# Altium project iMX6 Rex Development Baseboard V1I1.PrjPcb (part 4 of 5)

## Sheet [14] - RTC, EEPROM, GPIO, TOUCH SCREEN.SchDoc
size A3; DocumentNumber: 2; SheetNumber: 14; SheetTotal: 20
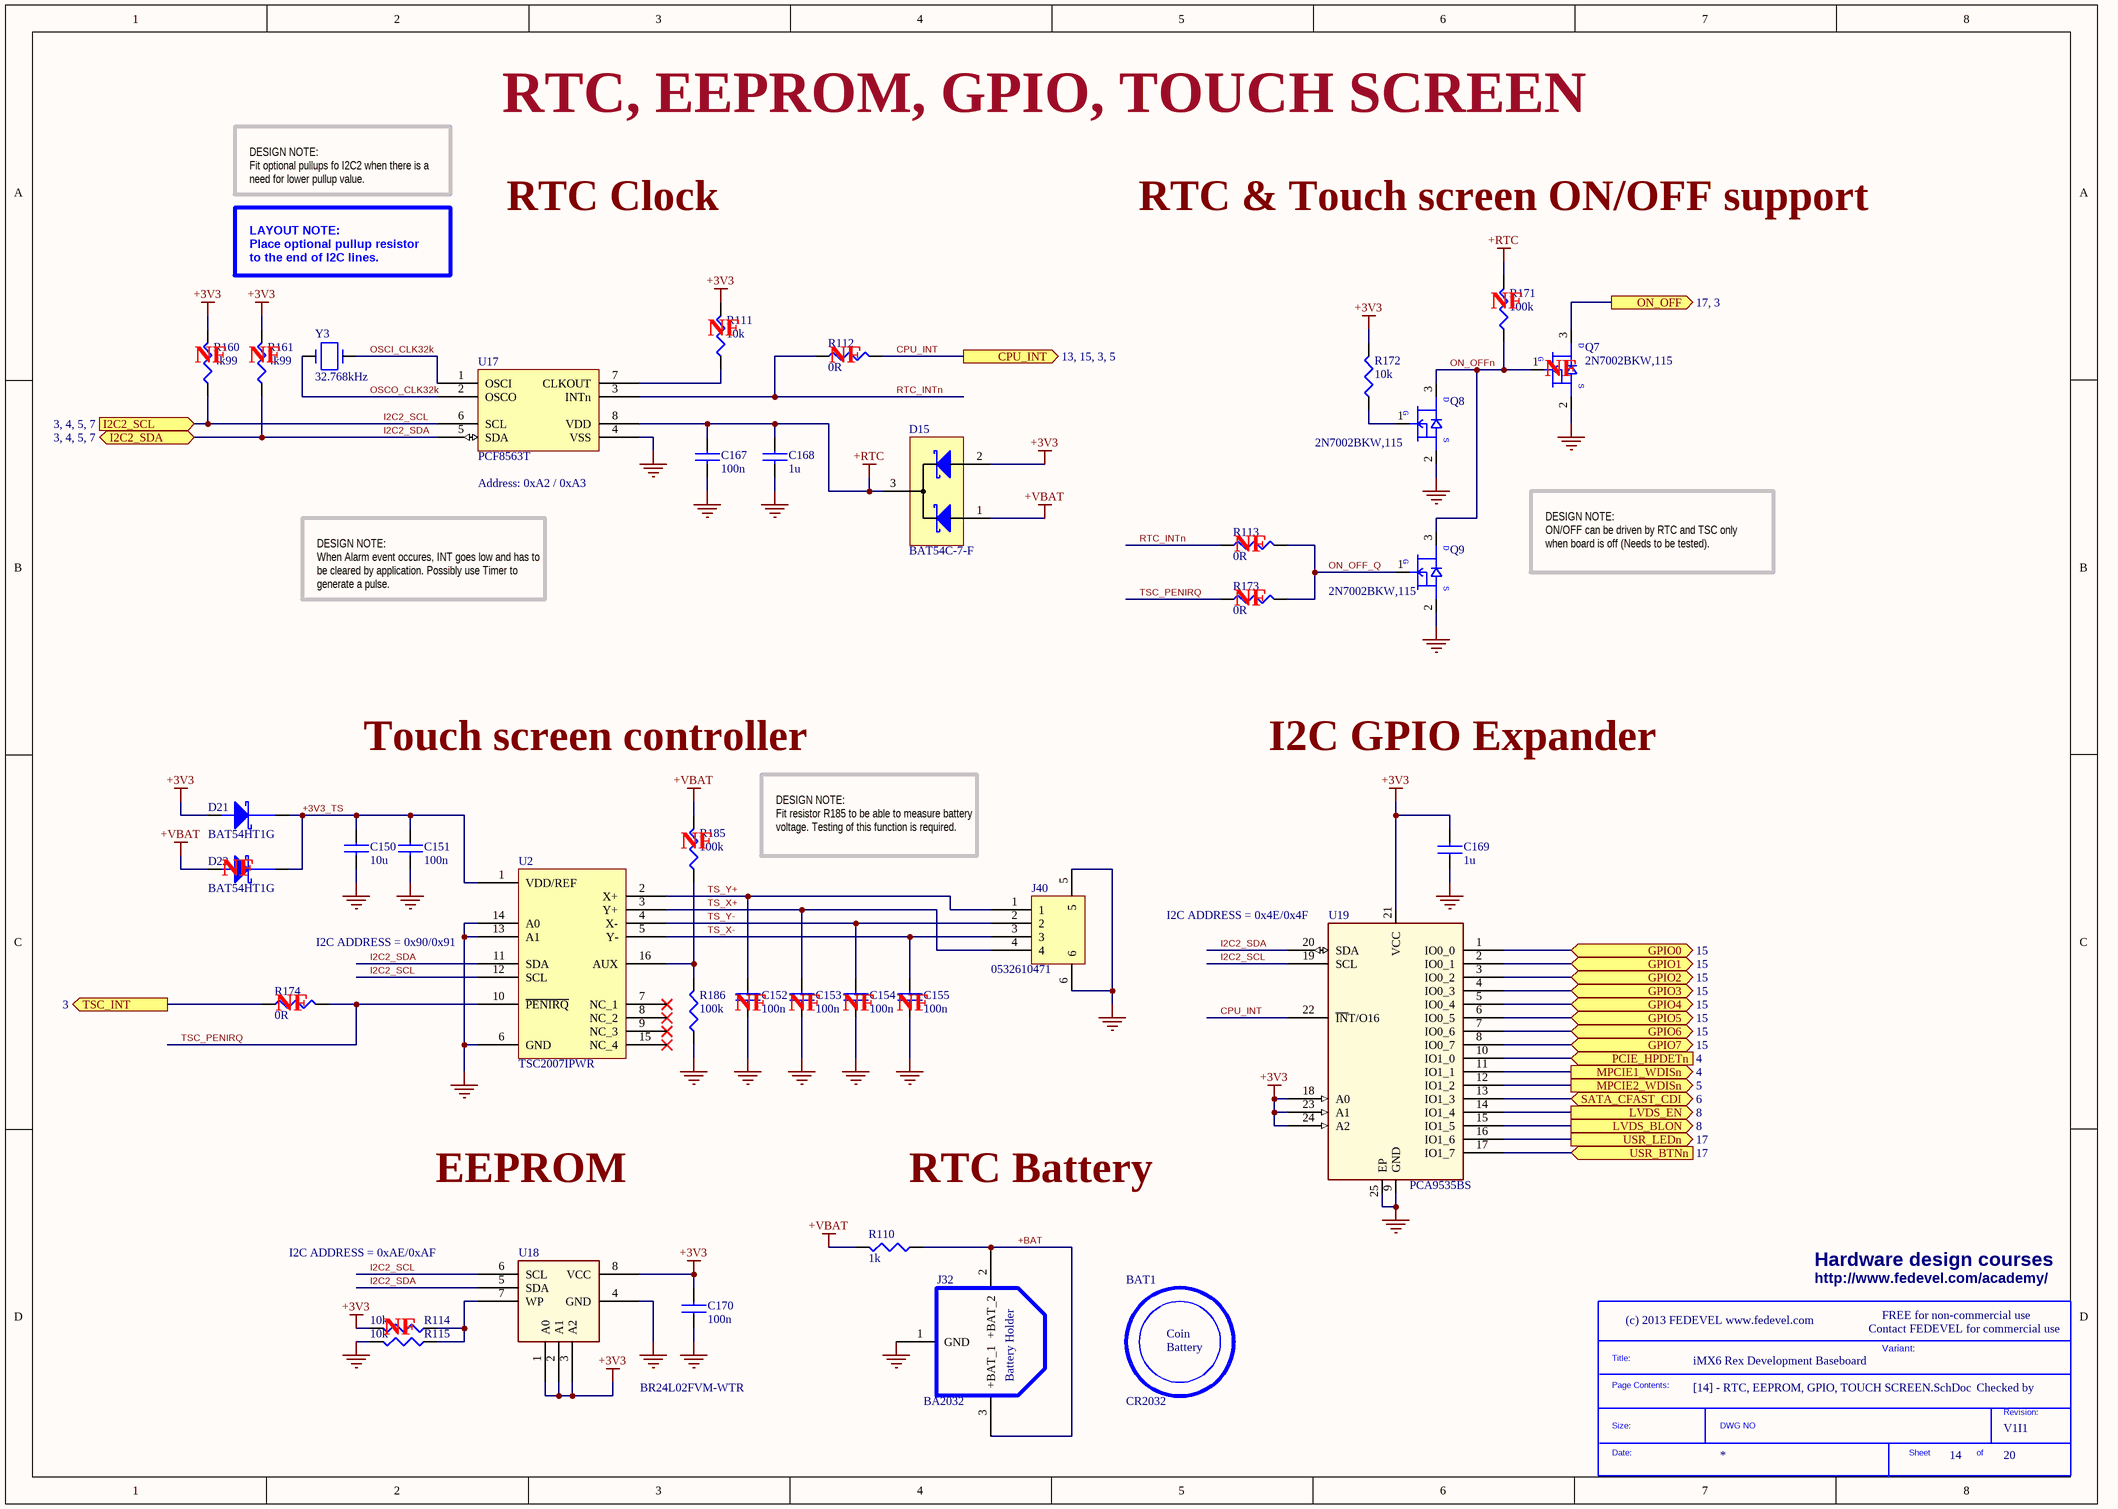
[diagram p10: [14] - RTC, EEPROM, GPIO, TOUCH SCREEN.SchDoc]

### Parts
(Parts that share a designator on the sheet are numbered #1, #2 ... from top to bottom, then left to right.)
*#9  SDTitleBlock  (value not drawn)  (graphical)
BAT1  CR2032  (mechanical)
C150  10u  [C0603]
C151  100n  [C0402]
C152  100n  [C0402]
C153  100n  [C0402]
C154  100n  [C0402]
C155  100n  [C0402]
C167  100n  [C0402]
C168  1u  [C0402]
C169  1u  [C0402]
C170  100n  [C0402]
D15  BAT54C-7-F  [SOT-23-3-123]
D21  BAT54HT1G  [SOD323]
D22  BAT54HT1G  [SOD323]
J32  BA2032  [BA2032]
J40  0532610471  [0532610471]
Q7  2N7002BKW,115  [SC70_SOT323]
Q8  2N7002BKW,115  [SC70_SOT323]
Q9  2N7002BKW,115  [SC70_SOT323]
R110  1k  [R0402]
R111  10k  [R0402]
R112  0R  [R0402]
R113  0R  [R0402]
R114  10k  [R0402]
R115  10k  [R0402]
R160  4k99  [R0402]
R161  4k99  [R0402]
R171  100k  [R0402]
R172  10k  [R0402]
R173  0R  [R0402]
R174  0R  [R0402]
R185  100k  [R0402]
R186  100k  [R0402]
U2  TSC2007IPWR  [PW (R-PDGO-G16)]
U17  PCF8563T  [8_SOIC_3.9MM]
U18  BR24L02FVM-WTR  [MSOP8 _SMALLER]
U19  PCA9535BS  [HVQFN24_4x4MM]
Y3  32.768kHz  [ABS06]

### Ports
CPU_INT (out, see 13, 15, 3, 5), GPIO0 (bidir, see 15), GPIO1 (bidir, see 15), GPIO2 (bidir, see 15), GPIO3 (bidir, see 15), GPIO4 (bidir, see 15), GPIO5 (bidir, see 15), GPIO6 (bidir, see 15), GPIO7 (bidir, see 15), I2C2_SCL (see 3, 4, 5, 7), I2C2_SDA (bidir, see 3, 4, 5, 7), LVDS_BLON (out, see 8), LVDS_EN (out, see 8), MPCIE1_WDISn (out, see 4), MPCIE2_WDISn (out, see 5), ON_OFF (out, see 17, 3), PCIE_HPDETn (in, see 4), SATA_CFAST_CDI (bidir, see 6), TSC_INT (out, see 3), USR_BTNn (in, see 17), USR_LEDn (out, see 17)

### Nets
+3V3: C169.2 C170.2 D15.2 D21.2(Anode) R111.2 R114.2 R160.2 R161.2 R172.2 U18.1(A0) U18.2(A1) U18.3(A2) U18.8(VCC) U19.18(A0) U19.21(VCC) U19.23(A1) U19.24(A2)
+RTC: C167.1 C168.1 D15.3 R171.2 U17.8(VDD)
+VBAT: D15.1 D22.2(Anode) R110.2 R185.2
GND: C150.2 C151.2 C152.2 C153.2 C154.2 C155.2 C167.2 C168.2 C169.1 C170.1 J32.1(GND) J40.5 J40.6 Q7.2(SOURCE) Q8.2(SOURCE) Q9.2(SOURCE) R115.2 R186.1 U2.6(GND) U2.13(A1) U2.14(A0) U17.4(VSS) U18.4(GND) U19.9(GND) U19.25(EP)
+3V3_TS: C150.1 C151.1 D21.1(Cathode) D22.1(Cathode) U2.1(VDD/REF)
+BAT: J32.2(+BAT_2) J32.3(+BAT_1) R110.1
CPU_INT: R112.2 U19.22(~{IN}T/O16) ; port CPU_INT
GPIO0: U19.1(IO0_0) ; port GPIO0
GPIO1: U19.2(IO0_1) ; port GPIO1
GPIO2: U19.3(IO0_2) ; port GPIO2
GPIO3: U19.4(IO0_3) ; port GPIO3
GPIO4: U19.5(IO0_4) ; port GPIO4
GPIO5: U19.6(IO0_5) ; port GPIO5
GPIO6: U19.7(IO0_6) ; port GPIO6
GPIO7: U19.8(IO0_7) ; port GPIO7
I2C2_SCL: R160.1 U2.12(SCL) U17.6(SCL) U18.6(SCL) U19.19(SCL) ; port I2C2_SCL
I2C2_SDA: R161.1 U2.11(SDA) U17.5(SDA) U18.5(SDA) U19.20(SDA) ; port I2C2_SDA
LVDS_BLON: U19.15(IO1_5) ; port LVDS_BLON
LVDS_EN: U19.14(IO1_4) ; port LVDS_EN
MPCIE1_WDISn: U19.11(IO1_1) ; port MPCIE1_WDISn
MPCIE2_WDISn: U19.12(IO1_2) ; port MPCIE2_WDISn
ON_OFF: Q7.3(DRAIN) ; port ON_OFF
ON_OFF_Q: Q9.1(GATE) R113.2 R173.2
ON_OFFn: Q7.1(GATE) Q8.3(DRAIN) Q9.3(DRAIN) R171.1
OSCI_CLK32k: U17.1(OSCI) Y3.1
OSCO_CLK32k: U17.2(OSCO) Y3.2
PCIE_HPDETn: U19.10(IO1_0) ; port PCIE_HPDETn
RTC_INTn: R112.1 R113.1 U17.3(INTn)
SATA_CFAST_CDI: U19.13(IO1_3) ; port SATA_CFAST_CDI
TS_X+: C153.1 J40.4 U2.3(Y+)
TS_X-: C155.1 J40.3 U2.5(Y-)
TS_Y+: C152.1 J40.1 U2.2(X+)
TS_Y-: C154.1 J40.2 U2.4(X-)
TSC_INT: R174.1 ; port TSC_INT
TSC_PENIRQ: R173.1 R174.2 U2.10(~{PENIRQ})
USR_BTNn: U19.17(IO1_7) ; port USR_BTNn
USR_LEDn: U19.16(IO1_6) ; port USR_LEDn
NetQ8_1: Q8.1(GATE) R172.1
NetR111_1: R111.1 U17.7(CLKOUT)
NetR114_1: R114.1 R115.1 U18.7(WP)
NetR185_1: R185.1 R186.2 U2.16(AUX)

Not connected (* = marked no-connect by the designer): U2 7(NC_1)* 8(NC_2)* 9(NC_3)* 15(NC_4)*

### Notes on the sheet
- RTC, EEPROM, GPIO, TOUCH SCREEN
- DESIGN NOTE:
  Fit optional pullups fo I2C2 when there is a need for lower pullup value.
- RTC Clock
- RTC & Touch screen ON/OFF support
- LAYOUT NOTE:
  Place optional pullup resistor to the end of I2C lines.
- (near R171) NF
- (near R160) NF
- (near R161) NF
- (near R111) NF
- (near R112) NF
- (near Q7) NF
- (near U17) Address: 0xA2 / 0xA3
- (near R113) NF
- DESIGN NOTE:
  ON/OFF can be driven by RTC and TSC only when board is off (Needs to be tested).
- DESIGN NOTE:
  When Alarm event occures, INT goes low and has to be cleared by application. Possibly use Timer to generate a pulse.
- (near R173) NF
- Touch screen controller
- I2C GPIO Expander
- (near R185) NF
- DESIGN NOTE:
  Fit resistor R185 to be able to measure battery voltage. Testing of this function is required.
- (near D22) NF
- (near U19) I2C ADDRESS = 0x4E/0x4F
- I2C ADDRESS = 0x90/0x91
- (near R174) NF
- (near C152) NF
- (near C153) NF
- (near C154) NF
- (near C155) NF
- EEPROM
- RTC Battery
- I2C ADDRESS = 0xAE/0xAF
- Hardware design courses
- http://www.fedevel.com/academy/
- Contact FEDEVEL for commercial use
- FREE for non-commercial use
- NF
- Variant:
- Checked by
- (in symbol 2N7002BKW,115) D; G; S
- (in symbol BA2032) Battery Holder
- (in symbol CR2032) Coin; Battery
- (in symbol SDTitleBlock) Title:; Page Contents:; Revision:; Size:; DWG NO; Date:; Sheet; of

### Library data of the parts
BAT1 = CR2032: BATTERY LITHIUM COIN 3V 20MM; Manufacturer: Panasonic - BSG; Battery Cell Size: Coin, 20.0mm; Capacity: 225mAh; Discharge Rate: 200µA; Shipping Info: Due to possible restrictions, a change in ship method may be required.; .Checked SCH: RF; Supplier 1: Digi-Key; Manufacturer Part Number: CR2032; RoHS: RoHS Compliant By Exemption; Category: Battery Products; Stock 1: 2691411; Pricing 1: 1=0.28, 10=0.248, 50=0.22, 200=0.1925, 400=0.176, 800=0.165, 1200=0.15125 (USD); Battery Chemistry: Lithium; Voltage - Rated: 3V; Size / Dimension: 0.79" Dia x 0.13" H (20.0mm x 3.2mm); Termination Style: Requires Holder; Weight: 0.1 oz (2.85g); ComponentLink1URL: http://panasonic.com/industrial/includes/pdf/Panasonic_Lithium_CR2032_CR2330.pdf; ComponentLink1Description: http://panasonic.com/industrial/includes/pdf/Panasonic_Lithium_CR2032_CR2330.pdf; Supplier Part Number 1: P189-ND; .Checked PCB: RF
C150 = C1608X5R0J106M: CAP CER 10UF 6.3V X5R 20% 0603; Manufacturer: TDK Corporation; Capacitance: 10µF; Value: 10µF; .Checked PCB: used; Description: CAP CER 10UF 6.3V 20% X5R 0603; Category: Capacitors; Supplier Part Number: 445-4112-1-ND; Manufacturer Part Number: C1608X5R0J106M; Operating Temperature: -55°C ~ 85°C; Package / Case: 0603 (1608 Metric); Price 1k [$]: 0.08580; .Checked SCH: used; Voltage - Rated: 6.3V; Features: Low ESR; Supplier: Digikey; Supplier 1: Digi-Key; Supplier Part Number 1: 445-4112-1-ND; RoHS: RoHS Compliant; Stock 1: 48157; Pricing 1: 1=0.46, 10=0.363, 100=0.1898, 250=0.14024, 500=0.1089, 1000=0.0858 (USD); Tolerance: ±20%; Temperature Coefficient: X5R; Mounting Type: Surface Mount, MLCC; Applications: General Purpose; Ratings: -; Size / Dimension: 0.063" L x 0.031" W (1.60mm x 0.80mm); Height - Seated (Max): -; Thickness (Max): 0.037" (0.95mm); Lead Spacing: -; Packaging: Cut Tape (CT); Lead Style: -; ComponentLink1URL: http://www.tdk.com/pdf/general_B11.pdf; ComponentLink1Description: http://www.tdk.com/pdf/general_B11.pdf
C151-C155 C167 C170 = C1005X5R1H104K: CAP CER .10UF 50V X5R 10% 0402; Manufacturer: TDK Corporation; Capacitance: 0.1µF; Value: 100nF; .Checked PCB: used; Description: CAP CER 0.1UF 50V 10% X5R 0402; Category: Capacitors; Supplier Part Number: 445-5942-1-ND; Manufacturer Part Number: C1005X5R1H104K; Operating Temperature: -55°C ~ 85°C; Package / Case: 0402 (1005 Metric); Price 1k [$]: 0.02340; .Checked SCH: used; Voltage - Rated: 50V; Supplier: Digikey; Supplier 1: Digi-Key; Supplier Part Number 1: 445-5942-1-ND; RoHS: RoHS Compliant; Stock 1: 106926; Pricing 1: 1=0.27, 10=0.18, 100=0.072, 250=0.05176, 500=0.0369, 1000=0.027 (USD); Tolerance: ±10%; Temperature Coefficient: X5R; Mounting Type: Surface Mount, MLCC; Applications: General Purpose; Ratings: -; Size / Dimension: 0.039" L x 0.020" W (1.00mm x 0.50mm); Height - Seated (Max): -; Thickness (Max): 0.022" (0.55mm); Lead Spacing: -; Features: -; Packaging: Cut Tape (CT); Lead Style: -; ComponentLink1URL: http://www.tdk.co.jp/tefe02/e412_c.pdf; ComponentLink1Description: http://www.tdk.co.jp/tefe02/e412_c.pdf
C168 C169 = C1005X5R1C105K: CAP CER 1.0UF 16V X5R 0402; Manufacturer: TDK Corporation; Capacitance: 1.0µF; Value: 1uF; .Checked PCB: used; Description: CAP CER 1UF 16V 10% X5R 0402; Tolerance: ±10%; Category: Capacitors; Manufacturer Part Number: C1005X5R1C105K; Operating Temperature: -55°C ~ 85°C; Package / Case: 0402 (1005 Metric); Price 1k [$]: 0.02080; .Checked SCH: used; Voltage - Rated: 16V; Supplier Part Number: 445-4978-1-ND; Supplier: Digikey; Supplier 1: Digi-Key; Supplier Part Number 1: 445-4978-1-ND; RoHS: RoHS Compliant; Stock 1: 341010; Pricing 1: 1=0.24, 10=0.16, 100=0.064, 250=0.046, 500=0.0328, 1000=0.024 (USD); Temperature Coefficient: X5R; Mounting Type: Surface Mount, MLCC; Applications: General Purpose; Ratings: -; Size / Dimension: 0.039" L x 0.020" W (1.00mm x 0.50mm); Height - Seated (Max): -; Thickness (Max): 0.022" (0.55mm); Lead Spacing: -; Features: -; Packaging: Cut Tape (CT); Lead Style: -; ComponentLink1URL: http://www.tdk.co.jp/tefe02/e412_c.pdf; ComponentLink1Description: http://www.tdk.co.jp/tefe02/e412_c.pdf
D15 = BAT54C-7-F: DIODE SCHOTTKY DUAL 30V SOT23-3; Manufacturer: Diodes Inc; .Checked PCB: used; Current - Average Rectified (Io) (per Diode): 200mA (DC; Speed: Small Signal =< 200mA (Io), Any Speed; Voltage - Forward (Vf) (Max) @ If: 800mV @ 100mA; Current - Reverse Leakage @ Vr: 2µA @ 25V; Reverse Recovery Time (trr): 5ns; Diode Configuration: 1 Pair Common Cathode; .Checked SCH: used; Category: Discrete Semiconductor Products; Manufacturer Part Number: BAT54C-7-F; Package / Case: TO-236-3, SC-59, SOT-23-3; Price 1k [$]: 0.04500; Value: BAT54C-7-F; Family: Diodes, Rectifiers - Arrays; oltage - DC Reverse (Vr) (Max): 30V; Diode Type: Schottky; Supplier Part Number: BAT54C-FDICT-ND; Supplier: Digikey; Supplier 1: Digi-Key; Supplier Part Number 1: BAT54C-FDICT-ND; RoHS: RoHS Compliant; Stock 1: 67687; Pricing 1: 1=0.38, 10=0.255, 100=0.12, 250=0.08552, 500=0.06526, 1000=0.045 (USD); Voltage - DC Reverse (Vr) (Max): 30V; Mounting Type: Surface Mount; Supplier Device Package: SOT-23-3; Packaging: Cut Tape (CT); ComponentLink1URL: http://www.diodes.com/datasheets/ds11005.pdf; ComponentLink1Description: http://www.diodes.com/datasheets/ds11005.pdf
D21 D22 = BAT54HT1G: DIODE SCHOTTKY 30V 0.2A SOD323; Manufacturer: Fairchild Semiconductor; Current - Average Rectified (Io): 200mA; Voltage - Forward (Vf) (Max) @ If: 800mV @ 100mA; Speed: Small Signal =< 200mA (Io), Any Speed; Reverse Recovery Time (trr): 5ns; Current - Reverse Leakage @ Vr: 2µA @ 25V; Capacitance @ Vr, F: 10pF @ 1V, 1MHz; Thermal Resistance: 600°C/W Ja; .Creator: MM; .Checked PCB: RF, used by MM; Supplier 1: Digi-Key; Manufacturer Part Number: BAT54HT1G; RoHS: RoHS Compliant; Category: Discrete Semiconductor Products; Stock 1: 11388; Pricing 1: 1=0.3, 10=0.276, 25=0.1984, 100=0.1543, 250=0.09696, 500=0.0826, 1000=0.05628 (USD); Packaging: Cut Tape (CT); Diode Type: Schottky; Voltage - DC Reverse (Vr) (Max): 30V; Mounting Type: Surface Mount; Package / Case: SC-76, SOD-323; Supplier Device Package: SOD-323; Operating Temperature - Junction: -55°C ~ 150°C; ComponentLink1URL: http://www.fairchildsemi.com/ds/BA/BAT54HT1G.pdf; ComponentLink1Description: http://www.fairchildsemi.com/ds/BA/BAT54HT1G.pdf; Supplier Part Number 1: BAT54HT1GCT-ND; .Checked SCH: MM
J32 = BA2032: HOLDER COIN CELL CR2032 EJECT; Manufacturer: MPD (Memory Protection Devices); Battery Type, Function: Coin Cell, Holder; Style: Holder (Open); Battery Cell Size: Coin, 20.0mm; Number of Cells: 1; Battery Series: 2032; .Creator: MM; .Checked SCH: RF, used by MM; Supplier 1: Digi-Key; Manufacturer Part Number: BA2032; RoHS: RoHS Compliant; Category: Battery Products; Stock 1: 59526; Pricing 1: 1=1.16, 10=1.077, 100=0.97, 500=0.83, 1000=0.72 (USD); Mounting Type: PCB, Through Hole; Termination Style: PC Pin; Height Above Board: 0.264" (6.71mm); Operating Temperature: -40°C ~ 225°C; ComponentLink1URL: http://www.memoryprotectiondevices.com/datasheets/BA2032-datasheet.pdf; ComponentLink1Description: http://www.memoryprotectiondevices.com/datasheets/BA2032-datasheet.pdf; Supplier Part Number 1: BA2032-ND; .Checked PCB: MM
J40 = 0532610471: CONN HEADER 4POS 1.25MM R/A SMD; Manufacturer: Molex Inc; Connector Type: Header, Shrouded; Number of Positions: 4; Number of Positions Loaded: All; Pitch: 0.049" (1.25mm); .Creator: MM; Supplier 1: Digi-Key; Manufacturer Part Number: 0532610471; RoHS: RoHS Compliant; Category: Connectors, Interconnects; Stock 1: 9616; Pricing 1: 1=1.5, 10=1.318, 25=1.2404, 50=1.1888, 100=1.1372, 250=1.0338, 500=0.9304 (USD); Packaging: Cut Tape (CT); Contact Type: Blade Pin; Number of Rows: 1; Row Spacing: -; Contact Mating Length: -; Mounting Type: Surface Mount, Right Angle; Termination: Solder; Fastening Type: -; Features: Solder Retention; Contact Finish: Tin; Contact Finish Thickness: 39µin (1.00µm); Color: Natural; ComponentLink1URL: http://www.molex.com/pdm_docs/sd/532610471_sd.pdf; ComponentLink1Description: http://www.molex.com/pdm_docs/sd/532610471_sd.pdf; Supplier Part Number 1: WM7622CT-ND; .Checked PCB: MM; .Checked SCH: MM
Q7-Q9 = 2N7002BKW,115: MOSFET N-CH 60V 310MA SOT323; Manufacturer: NXP Semiconductors; FET Type: MOSFET N-Channel, Metal Oxide; FET Feature: Logic Level Gate; Rds On (Max) @ Id, Vgs: 1.6 Ohm @ 500mA, 10V; Vgs(th) (Max) @ Id: 2.1V @ 250µA; Gate Charge (Qg) @ Vgs: 0.6nC @ 4.5V; Input Capacitance (Ciss) @ Vds: 50pF @ 10V; Power - Max: 275mW; .Checked PCB: RF; Supplier 1: Digi-Key; Supplier Part Number 1: 568-5980-1-ND; Manufacturer Part Number: 2N7002BKW,115; RoHS: RoHS Compliant; Category: Discrete Semiconductor Products; Stock 1: 15666; Pricing 1: 1=0.39, 10=0.354, 25=0.2548, 100=0.1983, 250=0.12456, 500=0.10616, 1000=0.07233 (USD); Drain to Source Voltage (Vdss): 60V; Current - Continuous Drain (Id) @ 25° C: 310mA; Mounting Type: Surface Mount; Package / Case: SC-70, SOT-323; Supplier Device Package: SC-70; Packaging: Cut Tape (CT); ComponentLink1URL: http://www.nxp.com/documents/data_sheet/2N7002BKW.pdf; ComponentLink1Description: http://www.nxp.com/documents/data_sheet/2N7002BKW.pdf; .Checked SCH: RF
R110 = RC0402FR-071KL: RES 1.00K OHM 1/16W 1% 0402 SMD; Manufacturer: Yageo; Power (Watts): 0.063W, 1/16W; .Checked PCB: used; Temperature Coefficient: ±100ppm/°C; Category: Resistors; Supplier Part Number: 311-1.00KLRCT-ND; Manufacturer Part Number: RC0402FR-071KL; Package / Case: 0402 (1005 Metric); Price 1k [$]: 0.01421; Resistance (Ohms): 1K; Tolerance: ±1%; Value: 1k; .Checked SCH: used; Supplier: Digikey; Supplier 1: Digi-Key; Supplier Part Number 1: 311-1.00KLRCT-ND; RoHS: RoHS Compliant; Stock 1: 1753477; Pricing 1: 10=0.014, 50=0.0104, 100=0.0079, 250=0.00584, 500=0.00432, 1000=0.00288 (USD); Composition: Thick Film; Features: -; Size / Dimension: 0.039" L x 0.020" W (1.00mm x 0.50mm); Height: 0.016" (0.40mm); Number of Terminations: 2; Packaging: Cut Tape (CT); ComponentLink1URL: http://www.yageo.com/documents/recent/PYu-RC0402_51_RoHS_L_6.pdf; ComponentLink1Description: http://www.yageo.com/documents/recent/PYu-RC0402_51_RoHS_L_6.pdf
R111 R114 R115 R172 = RC0402FR-0710KL: RES 10.0K OHM 1/16W 1% 0402 SMD; Manufacturer: Yageo; Power (Watts): 0.063W, 1/16W; .Checked PCB: used; Temperature Coefficient: ±100ppm/°C; Category: Resistors; Manufacturer Part Number: RC0402FR-0710KL; Package / Case: 0402 (1005 Metric); Price 1k [$]: 0.01421; Resistance (Ohms): 10K; Tolerance: ±1%; Value: 10k; .Checked SCH: used; Supplier Part Number: 311-10.0KLRCT-ND; Supplier: Digikey; Supplier 1: Digi-Key; Supplier Part Number 1: 311-10.0KLRCT-ND; RoHS: RoHS Compliant; Stock 1: 2916495; Pricing 1: 10=0.014, 50=0.0104, 100=0.0079, 250=0.00584, 500=0.00432, 1000=0.00288 (USD); Composition: Thick Film; Features: -; Size / Dimension: 0.039" L x 0.020" W (1.00mm x 0.50mm); Height: 0.016" (0.40mm); Number of Terminations: 2; Packaging: Cut Tape (CT); ComponentLink1URL: http://www.yageo.com/documents/recent/PYu-RC0402_51_RoHS_L_6.pdf; ComponentLink1Description: http://www.yageo.com/documents/recent/PYu-RC0402_51_RoHS_L_6.pdf
R112 R113 R173 R174 = RC0402JR-070RL: RES 0.0 OHM 1/16W 0402 SMD; Manufacturer: Yageo; Resistance (Ohms): 0.0; Power (Watts): 0.063W, 1/16W; Tolerance: Jumper; .Checked PCB: used; Category: Resistors; Manufacturer Part Number: RC0402JR-070RL; Package / Case: 0402 (1005 Metric); Price 1k [$]: 0.01389; Value: 0R; .Checked SCH: used; Supplier Part Number: 311-0.0JRCT-ND; Supplier: Digikey; Supplier 1: Digi-Key; Supplier Part Number 1: 311-0.0JRCT-ND; RoHS: RoHS Compliant; Stock 1: 1106330; Pricing 1: 10=0.012, 50=0.009, 100=0.0069, 250=0.00512, 500=0.0038, 1000=0.00253 (USD); Composition: Thick Film; Features: -; Temperature Coefficient: -; Size / Dimension: 0.039" L x 0.020" W (1.00mm x 0.50mm); Height: 0.016" (0.40mm); Number of Terminations: 2; Packaging: Cut Tape (CT); ComponentLink1URL: http://www.yageo.com/documents/recent/PYu-RC0402_51_RoHS_L_6.pdf; ComponentLink1Description: http://www.yageo.com/documents/recent/PYu-RC0402_51_RoHS_L_6.pdf
R160 R161 = RMCF0402FT4K99: RES TF 4.99K OHM 1% 1/16W 0402; Manufacturer: Stackpole Electronics Inc; Power (Watts): 0.063W, 1/16W; .Checked PCB: used; Temperature Coefficient: ±100ppm/°C; Category: Resistors; Supplier Part Number: RMCF0402FT4K99CT-ND; Manufacturer Part Number: RMCF0402FT4K99; Package / Case: 0402 (1005 Metric); Price 1k [$]: 0.00384; Resistance (Ohms): 4.99K; Tolerance: ±1%; Value: 4k99; .Checked SCH: used; Supplier: Digikey; Supplier 1: Digi-Key; Supplier Part Number 1: RMCF0402FT4K99CT-ND; RoHS: RoHS Compliant; Stock 1: 48509; Pricing 1: 1=0.04, 10=0.025, 50=0.0138, 100=0.0105, 250=0.0078, 500=0.00576, 1000=0.00384 (USD); Composition: Thick Film; Features: -; Size / Dimension: 0.039" L x 0.020" W (1.00mm x 0.50mm); Height: 0.016" (0.40mm); Number of Terminations: 2; Packaging: Cut Tape (CT); ComponentLink1URL: http://www.seielect.com/Catalog/SEI-RMCF.pdf; ComponentLink1Description: http://www.seielect.com/Catalog/SEI-RMCF.pdf
R171 R185 R186 = RMCF0402FT100K: RES 100K OHM 1/16W 1% 0402 SMD; Manufacturer: Stackpole Electronics Inc; Power (Watts): 0.063W, 1/16W; .Checked PCB: used; Temperature Coefficient: ±100ppm/°C; Category: Resistors; Supplier Part Number: RMCF0402FT100KCT-ND; Manufacturer Part Number: RMCF0402FT100K; Package / Case: 0402 (1005 Metric); Price 1k [$]: 0.00384; Resistance (Ohms): 100K; Tolerance: ±1%; Value: 100k; .Checked SCH: used; Supplier: Digikey; Supplier 1: Digi-Key; Supplier Part Number 1: RMCF0402FT100KCT-ND; RoHS: RoHS Compliant; Stock 1: 95; Pricing 1: 1=0.04, 10=0.025, 50=0.0138, 100=0.0105, 250=0.0078, 500=0.00576, 1000=0.00384 (USD); Composition: Thick Film; Features: -; Size / Dimension: 0.039" L x 0.020" W (1.00mm x 0.50mm); Height: 0.016" (0.40mm); Number of Terminations: 2; Packaging: Cut Tape (CT); ComponentLink1URL: http://www.seielect.com/Catalog/SEI-RMCF.pdf; ComponentLink1Description: http://www.seielect.com/Catalog/SEI-RMCF.pdf
U2 = TSC2007IPWR: IC TOUCH SCREEN 12BIT 16TSSOP; Manufacturer: Texas Instruments; Touch Panel Interface: 4-Wire; Number of Inputs/Keys: 1 TSC; Resolution (Bits): 12 b; Evaluation Tools: Available; Data Interface: I²C, Serial; Data Rate/Sampling Rate (SPS, BPS): 10k; Voltage Reference: External; Voltage - Supply: 1.2 V ~ 3.6 V; Current - Supply: 226.2µA; .Creator: MM; Supplier 1: Digi-Key; Manufacturer Part Number: TSC2007IPWR; RoHS: RoHS Compliant; Category: Integrated Circuits (ICs); Stock 1: 3563; Pricing 1: 1=4.23, 10=3.793, 25=3.4104, 100=3.1017, 250=2.80772, 500=2.5137, 1000=2.1168 (USD); Packaging: Cut Tape (CT); Type: Resistive; Operating Temperature: -40°C ~ 85°C; Mounting Type: Surface Mount; Package / Case: 16-TSSOP (0.173", 4.40mm Width); Supplier Device Package: 16-TSSOP; ComponentLink1URL: http://www.ti.com/lit/ds/symlink/tsc2007.pdf; ComponentLink1Description: http://www.ti.com/lit/ds/symlink/tsc2007.pdf; Supplier Part Number 1: 296-27124-1-ND; .Checked PCB: MM; .Checked SCH: MM
U17 = PCF8563T: IC REAL TIME CLK/CALENDAR 8-SOIC; Manufacturer: NXP Semiconductors; Manufacturer Part Number: PCF8563T/F4,118; .Checked PCB: used; Voltage - Supply: 1.8 V ~ 5.5 V; Interface: I²C, 2-Wire Serial; Time Format: HH:MM:SS (24 hr); Date Format: YY-MM-DD-dd; Voltage - Supply, Battery: 1 V ~ 5.5 V; .Checked SCH: used; Category: Integrated Circuits (ICs); Operating Temperature: -40°C ~ 85°C; Package / Case: 8-SOIC (0.154", 3.90mm Width); Price 1k [$]: 1.04000; Value: PCF8563T; Family: Clock/Timing - Real Time Clocks; Supplier Part Number: 568-1068-1-ND; Supplier: Digikey; Supplier 1: Digi-Key; Supplier Part Number 1: 568-1068-1-ND; RoHS: RoHS Compliant; Stock 1: 4926; Pricing 1: 1=1.91, 10=1.728, 25=1.548, 100=1.392, 250=1.236, 500=1.08, 1000=0.894 (USD); Type: Clock/Calendar; Features: Alarm, Leap Year, Watchdog Timer; Memory Size: -; Mounting Type: Surface Mount; Supplier Device Package: 8-SO; Packaging: Cut Tape (CT); ComponentLink1URL: http://www.nxp.com/documents/data_sheet/PCF8563.pdf; ComponentLink1Description: http://www.nxp.com/documents/data_sheet/PCF8563.pdf
U18 = BR24L02FVM-WTR: IC EEPROM 2KBIT 400KHZ 8MSOP; Manufacturer: Rohm Semiconductor; Format - Memory: EEPROMs - Serial; Memory Size: 2K (256 x 8); Interface: I²C, 2-Wire Serial; Voltage - Supply: 1.8 V ~ 5.5 V; .Checked PCB: RF; Supplier 1: Digi-Key; Supplier Part Number 1: BR24L02FVM-WCT-ND; Manufacturer Part Number: BR24L02FVM-WTR; RoHS: RoHS Compliant; Category: Integrated Circuits (ICs); Stock 1: 19923; Pricing 1: 1=0.78, 25=0.602, 100=0.531, 250=0.4602, 500=0.3894, 1000=0.30975 (USD); Memory Type: EEPROM; Speed: 400kHz; Operating Temperature: -40°C ~ 85°C; Package / Case: 8-VSSOP, 8-MSOP (0.110", 2.80mm Width); Supplier Device Package: 8-MSOP; Packaging: Cut Tape (CT); ComponentLink1URL: http://www.rohm.com/products/databook/eeprom/pdf/br24l-e.pdf; ComponentLink1Description: http://www.rohm.com/products/databook/eeprom/pdf/br24l-e.pdf; .Checked SCH: RF
U19 = PCA9535BS,118: IC I/O EXPANDER I2C 16B 24HVQFN; Manufacturer: NXP Semiconductors; Interface: I²C, SMBus; Number of I /O: 16; Interrupt Output: Yes; Frequency - Clock: 400kHz; Voltage - Supply: 2.3 V ~ 5.5 V; Includes: POR; .Checked PCB: RF; Supplier 1: Digi-Key; Supplier Part Number 1: 568-3376-1-ND; Manufacturer Part Number: PCA9535BS,118; RoHS: RoHS Compliant; Category: Integrated Circuits (ICs); Stock 1: 20623; Pricing 1: 1=2.11, 10=1.901, 25=1.7028, 100=1.5312, 250=1.3596, 500=1.188, 1000=0.9834, 2500=0.9174 (USD); Operating Temperature: -40°C ~ 85°C; Mounting Type: Surface Mount; Package / Case: 24-VFQFN Exposed Pad; Supplier Device Package: 24-HVQFN (4x4); Packaging: Cut Tape (CT); ComponentLink1URL: http://www.nxp.com/documents/data_sheet/PCA9535_PCA9535C.pdf; ComponentLink1Description: http://www.nxp.com/documents/data_sheet/PCA9535_PCA9535C.pdf; .Checked SCH: RF
Y3 = ABS06-32.768KHZ-9-1-T: CRYSTAL 32.768 KHZ 9.0 PF SMD; Manufacturer: Abracon Corporation; .Checked PCB: used; Frequency Stability: ±10ppm; Load Capacitance: 9pF; Operating Mode: Fundamental; .Checked SCH: used; Category: Crystals and Oscillators; Manufacturer Part Number: ABS06-32.768KHZ-9-1-T; Operating Temperature: -40°C ~ 85°C; Package / Case: 2-SMD, No Lead (DFN, LCC); Price 1k [$]: 1.24500; Value: 32.768kHz; Frequency: 32.768kHz; Supplier Part Number: 535-10247-1-ND; Supplier: Digikey; Supplier 1: Digi-Key; Supplier Part Number 1: 535-10247-1-ND; RoHS: RoHS Compliant; Stock 1: 5693; Pricing 1: 1=2.81, 10=2.438, 50=2.1376, 100=1.6875, 500=1.425 (USD); Type: kHz Crystal (Tuning Fork); Frequency Tolerance: ±10ppm; Mounting Type: Surface Mount; Size / Dimension: 0.079" L x 0.047" W (2.00mm x 1.20mm); Height: 0.024" (0.60mm); Packaging: Cut Tape (CT); ComponentLink1URL: http://www.abracon.com/Resonators/ABS06.pdf; ComponentLink1Description: http://www.abracon.com/Resonators/ABS06.pdf

## Sheet [16] - POWERS 5V, 3V3.SchDoc
size A2; DocumentNumber: 2; SheetNumber: 16; SheetTotal: 20
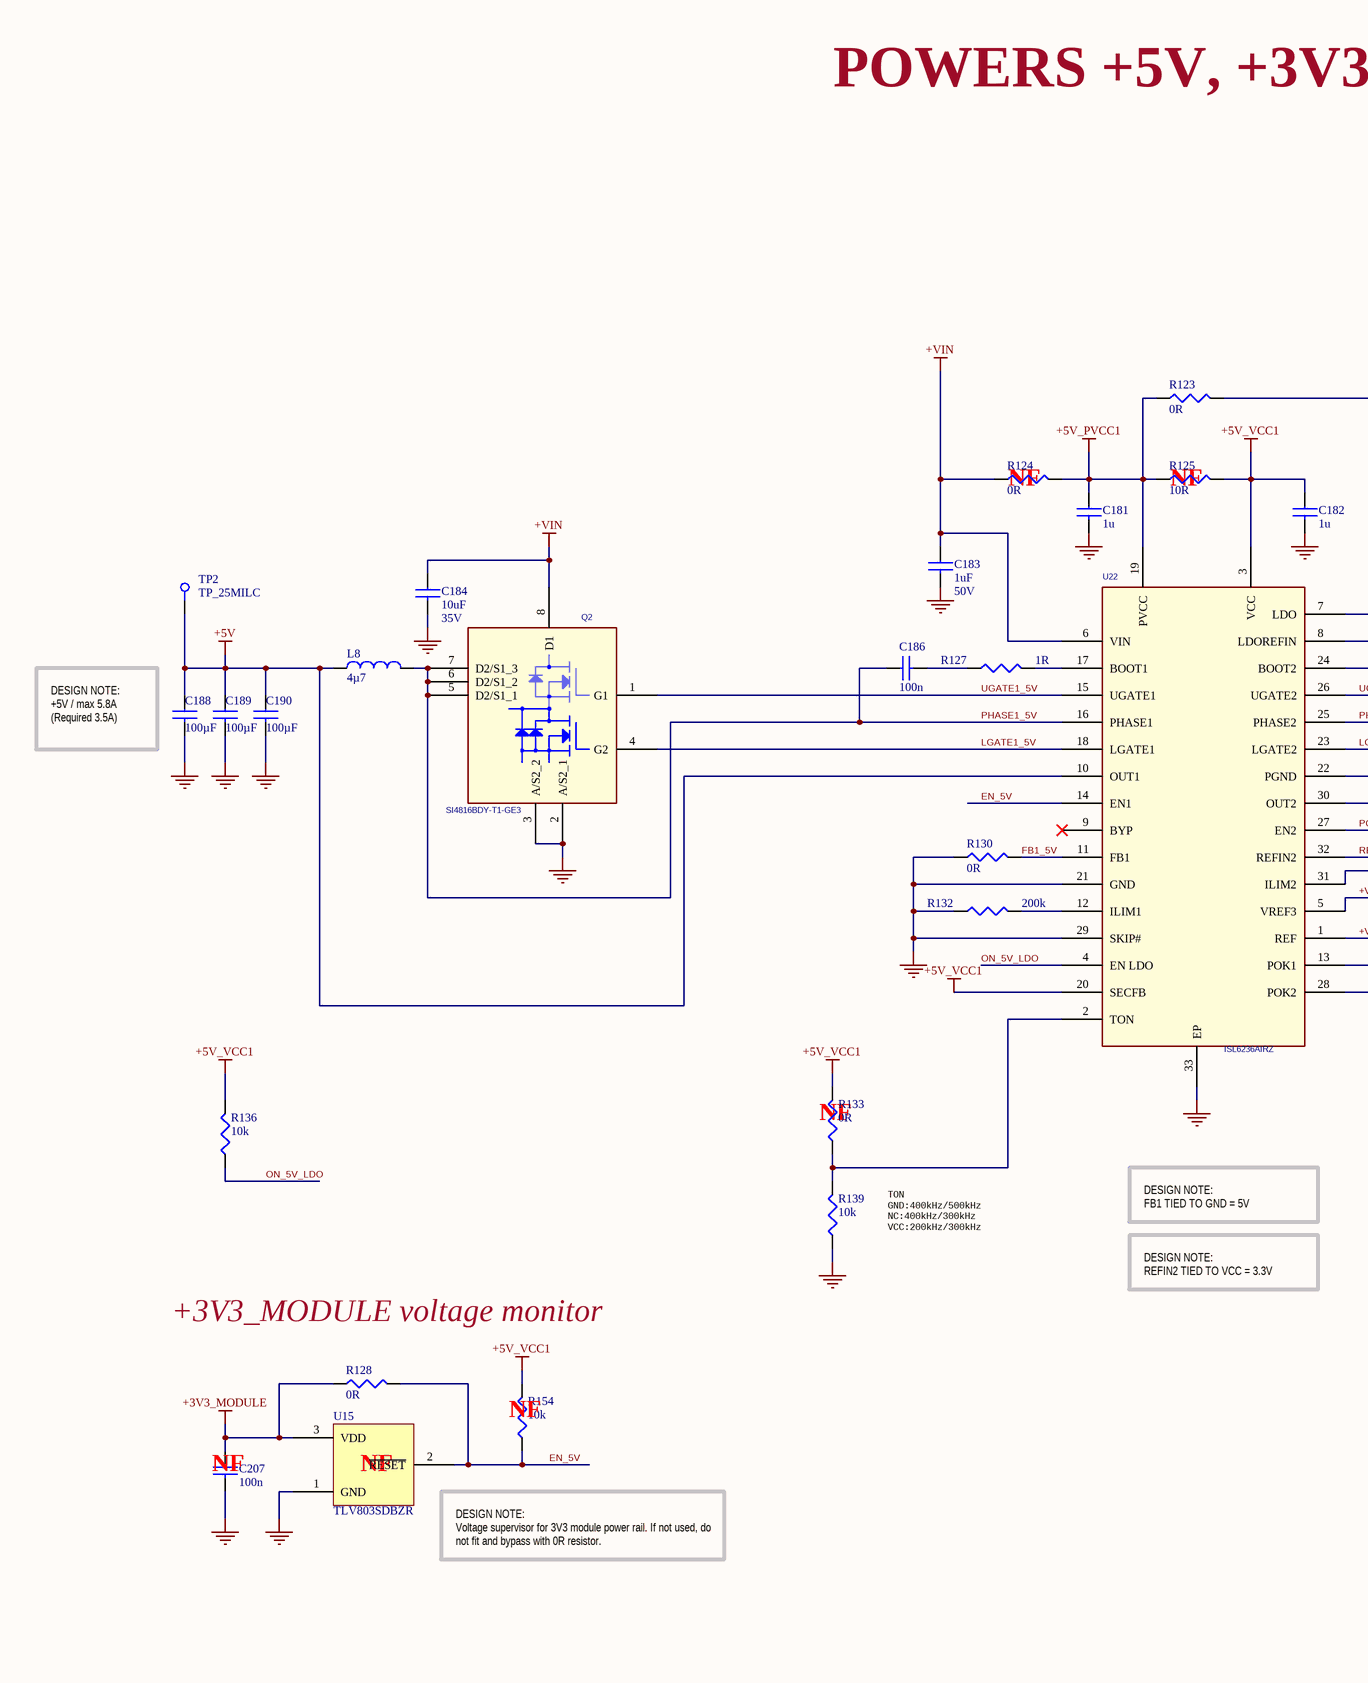
[diagram p11: [16] - POWERS 5V, 3V3.SchDoc, left]
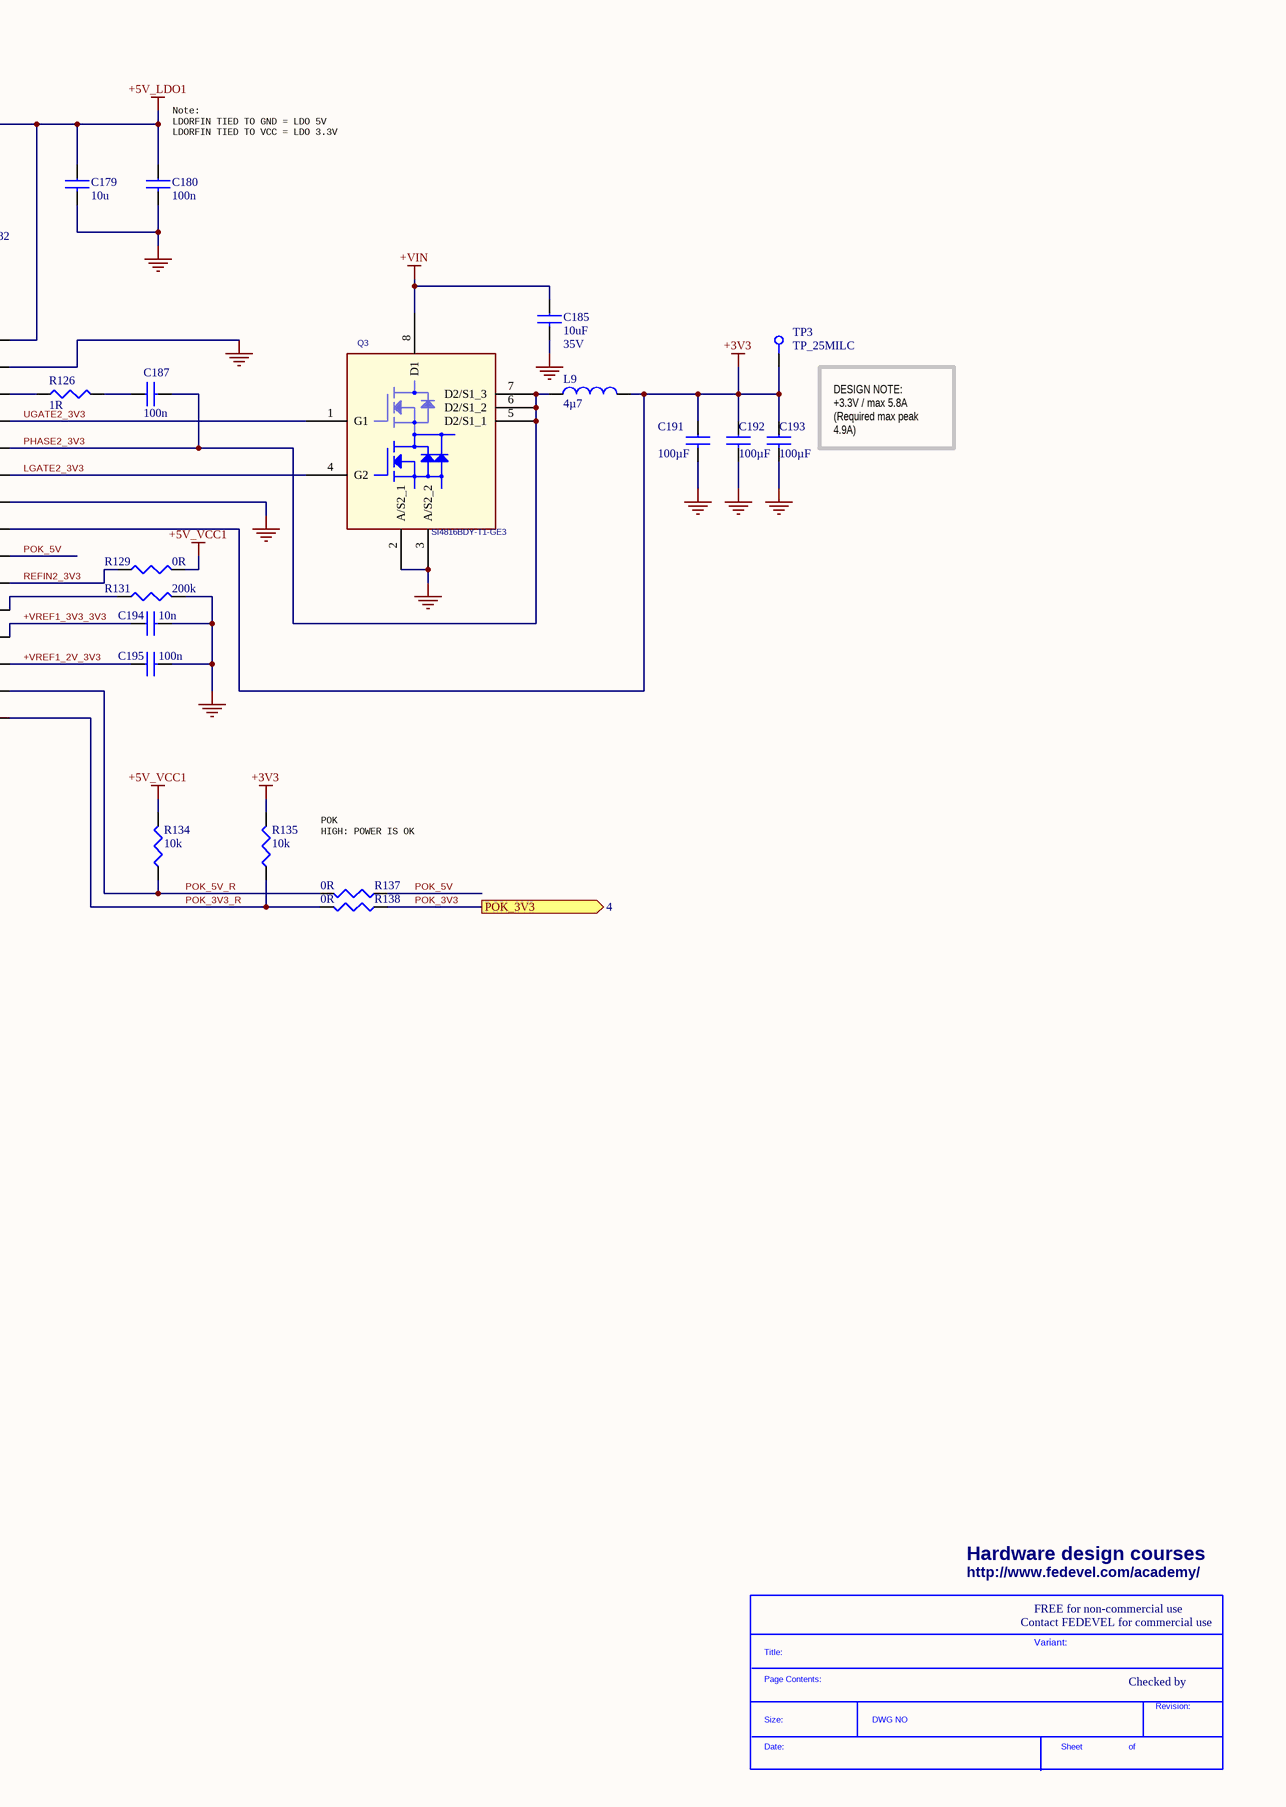
[diagram p12: [16] - POWERS 5V, 3V3.SchDoc, right]

### Parts
(Parts that share a designator on the sheet are numbered #1, #2 ... from top to bottom, then left to right.)
*#10  SDTitleBlock  (value not drawn)  (graphical)
C179  10u  [C0603]
C180  100n  [C0402]
C181  1u  [C0402]
C182  1u  [C0402]
C183  1uF  Voltage - Rated: 50V  [C0805]
C184  10uF  Voltage - Rated: 35V  [C1206]
C185  10uF  Voltage - Rated: 35V  [C1206]
C186  100n  [C0402]
C187  100n  [C0402]
C188  100µF  [C1206]
C189  100µF  [C1206]
C190  100µF  [C1206]
C191  100µF  [C1206]
C192  100µF  [C1206]
C193  100µF  [C1206]
C194  10n  [C0402]
C195  100n  [C0402]
C207  100n  [C0402]
L8  4µ7  [IHLP_255MILx270MIL]
L9  4µ7  [IHLP_255MILx270MIL]
Q2  SI4816BDY-T1-GE3  [8_SOIC_3.9MM]
Q3  SI4816BDY-T1-GE3  [8_SOIC_3.9MM]
R123  0R  [R0402]
R124  0R  [R0402]
R125  10R  [R0402]
R126  1R  [R0402]
R127  1R  [R0402]
R128  0R  [R0402]
R129  0R  [R0402]
R130  0R  [R0402]
R131  200k  [R0402]
R132  200k  [R0402]
R133  0R  [R0402]
R134  10k  [R0402]
R135  10k  [R0402]
R136  10k  [R0402]
R137  0R  [R0402]
R138  0R  [R0402]
R139  10k  [R0402]
R154  10k  [R0402]
TP2  TP_25MILC  [TP_25C]  (no BOM)
TP3  TP_25MILC  [TP_25C]  (no BOM)
U15  TLV803SDBZR  [DBZ]
U22  ISL6236AIRZ  [32_VFQFN_EXPOSED_PAD]

### Ports
POK_3V3 (see 4)

### Nets
+3V3: C191.1 C192.1 C193.1 L9.2 R135.2 TP3.1 U22.30(OUT2)
+3V3_MODULE: C207.1 R128.1 U15.3(VDD)
+5V: C188.1 C189.1 C190.1 L8.1 TP2.1 U22.10(OUT1)
+5V_LDO1: C179.1 C180.1 R123.2 U22.7(LDO)
+5V_PVCC1: C181.1 R123.1 R124.2 R125.1 U22.19(PVCC)
+5V_VCC1: C182.1 R125.2 R129.2 R133.2 R134.2 R136.2 R154.2 U22.3(VCC) U22.20(SECFB)
+VIN: C183.1 C184.1 C185.1 Q2.8(D1) Q3.8(D1) R124.1 U22.6(VIN)
GND: C179.2 C180.2 C181.2 C182.2 C183.2 C184.2 C185.2 C188.2 C189.2 C190.2 C191.2 C192.2 C193.2 C194.2 C195.2 C207.2 Q2.2(A/S2_1) Q2.3(A/S2_2) Q3.2(A/S2_1) Q3.3(A/S2_2) R130.1 R131.2 R132.1 R139.1 U15.1(GND) U22.8(LDOREFIN) U22.21(GND) U22.22(PGND) U22.29(SKIP#) U22.33(EP)
+VREF1_2V_3V3: C195.1 U22.1(REF)
+VREF1_3V3_3V3: C194.1 U22.5(VREF3)
EN_5V: R128.2 R154.1 U15.2(~{RESET}) U22.14(EN1)
FB1_5V: R130.2 U22.11(FB1)
LGATE1_5V: Q2.4(G2) U22.18(LGATE1)
LGATE2_3V3: Q3.4(G2) U22.23(LGATE2)
ON_5V_LDO: R136.1 U22.4(EN_LDO)
PHASE1_5V: C186.1 L8.2 Q2.5(D2/S1_1) Q2.6(D2/S1_2) Q2.7(D2/S1_3) U22.16(PHASE1)
PHASE2_3V3: C187.2 L9.1 Q3.5(D2/S1_1) Q3.6(D2/S1_2) Q3.7(D2/S1_3) U22.25(PHASE2)
POK_3V3: R138.1 ; port POK_3V3
POK_3V3_R: R135.1 R138.2 U22.28(POK2)
POK_5V: R137.1 U22.27(EN2)
POK_5V_R: R134.1 R137.2 U22.13(POK1)
REFIN2_3V3: R129.1 U22.32(REFIN2)
UGATE1_5V: Q2.1(G1) U22.15(UGATE1)
UGATE2_3V3: Q3.1(G1) U22.26(UGATE2)
NetC186_2: C186.2 R127.1
NetC187_1: C187.1 R126.2
NetR126_1: R126.1 U22.24(BOOT2)
NetR127_2: R127.2 U22.17(BOOT1)
NetR131_1: R131.1 U22.31(ILIM2)
NetR132_2: R132.2 U22.12(ILIM1)
NetR133_1: R133.1 R139.2 U22.2(TON)

Not connected (* = marked no-connect by the designer): U22 9(BYP)*

### Notes on the sheet
- POWERS +5V, +3V3
- (near C180) Note:
  LDORFIN TIED TO GND = LDO 5V
  LDORFIN TIED TO VCC = LDO 3.3V
- (near R124) NF
- (near R125) NF
- (near C188) DESIGN NOTE:
  +5V / max 5.8A
  (Required 3.5A)
- DESIGN NOTE:
  +3.3V / max 5.8A
  (Required max peak 4.9A)
- (near R133) NF
- POK
  HIGH: POWER IS OK
- DESIGN NOTE:
  FB1 TIED TO GND = 5V
- TON
  GND:400kHz/500kHz
  NC:400kHz/300kHz
  VCC:200kHz/300kHz
- DESIGN NOTE:
  REFIN2 TIED TO VCC = 3.3V
- +3V3_MODULE voltage monitor
- (near R154) NF
- (near C207) NF
- (near U15) NF
- DESIGN NOTE:
  Voltage supervisor for 3V3 module power rail. If not used, do not fit and bypass with 0R resistor.
- Hardware design courses
- http://www.fedevel.com/academy/
- Contact FEDEVEL for commercial use
- FREE for non-commercial use
- Variant:
- Checked by
- (in symbol SDTitleBlock) Title:; Page Contents:; Revision:; Size:; DWG NO; Date:; Sheet; of

### Library data of the parts
C179 = C1608X5R0J106M: as C150 on sheet [14] - RTC, EEPROM, GPIO, TOUCH SCREEN; Category: Capacitors; Manufacturer Part Number: C1608X5R0J106M; Operating Temperature: -55°C ~ 85°C; Package / Case: 0603 (1608 Metric); Price 1k [$]: 0.08580; .Checked SCH: used; Voltage - Rated: 6.3V; Features: Low ESR; Supplier Part Number: 445-4112-1-ND; Supplier: Digikey; Supplier 1: Digi-Key; Supplier Part Number 1: 445-4112-1-ND; RoHS: RoHS Compliant; Stock 1: 48157; Pricing 1: 1=0.46, 10=0.363, 100=0.1898, 250=0.14024, 500=0.1089, 1000=0.0858 (USD); Tolerance: ±20%; Temperature Coefficient: X5R; Mounting Type: Surface Mount, MLCC; Applications: General Purpose; Ratings: -; Size / Dimension: 0.063" L x 0.031" W (1.60mm x 0.80mm); Height - Seated (Max): -; Thickness (Max): 0.037" (0.95mm); Lead Spacing: -; Packaging: Cut Tape (CT); Lead Style: -; ComponentLink1URL: http://www.tdk.com/pdf/general_B11.pdf; ComponentLink1Description: http://www.tdk.com/pdf/general_B11.pdf
C180 C186 C187 C195 C207 = C1005X5R1H104K: as C151-C155 on sheet [14] - RTC, EEPROM, GPIO, TOUCH SCREEN; Category: Capacitors; Manufacturer Part Number: C1005X5R1H104K; Operating Temperature: -55°C ~ 85°C; Package / Case: 0402 (1005 Metric); Price 1k [$]: 0.02340; .Checked SCH: used; Voltage - Rated: 50V; Supplier Part Number: 445-5942-1-ND; Supplier: Digikey; Supplier 1: Digi-Key; Supplier Part Number 1: 445-5942-1-ND; RoHS: RoHS Compliant; Stock 1: 106926; Pricing 1: 1=0.27, 10=0.18, 100=0.072, 250=0.05176, 500=0.0369, 1000=0.027 (USD); Tolerance: ±10%; Temperature Coefficient: X5R; Mounting Type: Surface Mount, MLCC; Applications: General Purpose; Ratings: -; Size / Dimension: 0.039" L x 0.020" W (1.00mm x 0.50mm); Height - Seated (Max): -; Thickness (Max): 0.022" (0.55mm); Lead Spacing: -; Features: -; Packaging: Cut Tape (CT); Lead Style: -; ComponentLink1URL: http://www.tdk.co.jp/tefe02/e412_c.pdf; ComponentLink1Description: http://www.tdk.co.jp/tefe02/e412_c.pdf
C181 C182 = C1005X5R1C105K: as C168 on sheet [14] - RTC, EEPROM, GPIO, TOUCH SCREEN; Category: Capacitors; Manufacturer Part Number: C1005X5R1C105K; Operating Temperature: -55°C ~ 85°C; Package / Case: 0402 (1005 Metric); Price 1k [$]: 0.02080; .Checked SCH: used; Voltage - Rated: 16V; Supplier Part Number: 445-4978-1-ND; Supplier: Digikey; Supplier 1: Digi-Key; Supplier Part Number 1: 445-4978-1-ND; RoHS: RoHS Compliant; Stock 1: 341010; Pricing 1: 1=0.24, 10=0.16, 100=0.064, 250=0.046, 500=0.0328, 1000=0.024 (USD); Temperature Coefficient: X5R; Mounting Type: Surface Mount, MLCC; Applications: General Purpose; Ratings: -; Size / Dimension: 0.039" L x 0.020" W (1.00mm x 0.50mm); Height - Seated (Max): -; Thickness (Max): 0.022" (0.55mm); Lead Spacing: -; Features: -; Packaging: Cut Tape (CT); Lead Style: -; ComponentLink1URL: http://www.tdk.co.jp/tefe02/e412_c.pdf; ComponentLink1Description: http://www.tdk.co.jp/tefe02/e412_c.pdf
C183 = GRM21BR71H105KA12L: CAP CER 1UF 50V X7R 0805; Manufacturer: Murata Electronics North America; Capacitance: 1.0µF; .Checked PCB: used; Description: CAP CER 1UF 50V 10% X7R 0805; Tolerance: ±10%; Category: Capacitors; Manufacturer Part Number: GRM21BR71H105KA12L; Operating Temperature: -55°C ~ 125°C; Package / Case: 0805 (2012 Metric); Price 1k [$]: 0.1359; Value: 1uF; .Checked SCH: used; Supplier Part Number: 490-4736-1-ND; Supplier: Digikey; Supplier 1: Digi-Key; Supplier Part Number 1: 490-4736-1-ND; RoHS: RoHS Compliant; Stock 1: 422791; Pricing 1: 1=0.28, 10=0.254, 25=0.226, 50=0.1978, 100=0.1836, 250=0.16952, 500=0.16102, 750=0.14691, 1000=0.12995 (USD); Temperature Coefficient: X7R; Mounting Type: Surface Mount, MLCC; Applications: General Purpose; Ratings: -; Size / Dimension: 0.079" L x 0.049" W (2.00mm x 1.25mm); Height - Seated (Max): -; Thickness (Max): 0.053" (1.35mm); Lead Spacing: -; Features: -; Packaging: Cut Tape (CT); Lead Style: -; ComponentLink1URL: http://search.murata.co.jp/Ceramy/image/img/PDF/ENG/GRM21BR71H105KA12.pdf; ComponentLink1Description: http://search.murata.co.jp/Ceramy/image/img/PDF/ENG/GRM21BR71H105KA12.pdf
C184 C185 = GRM31CR6YA106KA12L: CAP CER 10UF 35V X5R 1206; Manufacturer: Murata Electronics North America; Capacitance: 10µF; .Checked PCB: used; Description: CAP CER 10UF 35V 10% X5R 1206; Tolerance: ±10%; Category: Capacitors; Manufacturer Part Number: GRM31CR6YA106KA12L; Operating Temperature: -55°C ~ 85°C; Package / Case: 1206 (3216 Metric); Price 1k [$]: 0.19448; Value: 10uF; .Checked SCH: used; Supplier Part Number: 490-5524-1-ND; Supplier: Digikey; Supplier 1: Digi-Key; Supplier Part Number 1: 490-5524-1-ND; RoHS: RoHS Compliant; Stock 1: 76334; Pricing 1: 1=0.6, 10=0.501, 50=0.359, 100=0.3142, 250=0.24684, 500=0.2244, 1000=0.17952 (USD); Temperature Coefficient: X5R; Mounting Type: Surface Mount, MLCC; Applications: General Purpose; Ratings: -; Size / Dimension: 0.126" L x 0.063" W (3.20mm x 1.60mm); Height - Seated (Max): -; Thickness (Max): 0.071" (1.80mm); Lead Spacing: -; Features: -; Packaging: Cut Tape (CT); Lead Style: -; ComponentLink1URL: http://www.murata.com/products/catalog/pdf/c02e.pdf; ComponentLink1Description: http://www.murata.com/products/catalog/pdf/c02e.pdf
C188-C193 = C3216X5R1A107M: CAP CER 100UF 10V X5R 20% 1206; Manufacturer: TDK Corporation; .Checked PCB: used; Description: CAP CER 100UF 10V 20% X5R 1206; Capacitance: 100µF; Category: Capacitors; Manufacturer Part Number: C3216X5R1A107M; Operating Temperature: -55°C ~ 85°C; Package / Case: 1206 (3216 Metric); Price 1k [$]: 0.85800; Value: 100µF; .Checked SCH: used; Voltage - Rated: 10V; Supplier Part Number: 445-6007-1-ND; Supplier: Digikey; Supplier 1: Digi-Key; Supplier Part Number 1: 445-6007-1-ND; RoHS: RoHS Compliant; Stock 1: 28026; Pricing 1: 1=1.65, 10=1.353, 100=1.089, 250=0.957, 500=0.891, 1000=0.693 (USD); Tolerance: ±20%; Temperature Coefficient: X5R; Mounting Type: Surface Mount, MLCC; Applications: General Purpose; Ratings: -; Size / Dimension: 0.126" L x 0.063" W (3.20mm x 1.60mm); Height - Seated (Max): -; Thickness (Max): 0.071" (1.80mm); Lead Spacing: -; Features: -; Packaging: Cut Tape (CT); Lead Style: -; ComponentLink1URL: http://www.tdk.com/pdf/general_B11.pdf; ComponentLink1Description: http://www.tdk.com/pdf/general_B11.pdf
C194 = C1005X7R1C103K: CAP CER 10000PF 16V X7R 10% 0402; Manufacturer: TDK Corporation; Value: 10nF; .Checked PCB: used; Description: CAP CER 10000PF 16V 10% X7R 0402; Capacitance: 10000pF; Category: Capacitors; Manufacturer Part Number: C1005X7R1C103K; Operating Temperature: -55°C ~ 125°C; Package / Case: 0402 (1005 Metric); Price 1k [$]: 0.00416; .Checked SCH: used; Voltage - Rated: 16V; Supplier Part Number: 445-1262-1-ND; Supplier: Digikey; Supplier 1: Digi-Key; Supplier Part Number 1: 445-1262-1-ND; RoHS: RoHS Compliant; Stock 1: 511497; Pricing 1: 1=0.08, 10=0.05, 100=0.018, 250=0.013, 500=0.0096, 1000=0.0065 (USD); Tolerance: ±10%; Temperature Coefficient: X7R; Mounting Type: Surface Mount, MLCC; Applications: General Purpose; Ratings: -; Size / Dimension: 0.039" L x 0.020" W (1.00mm x 0.50mm); Height - Seated (Max): -; Thickness (Max): 0.022" (0.55mm); Lead Spacing: -; Features: -; Packaging: Cut Tape (CT); Lead Style: -; ComponentLink1URL: http://www.tdk.co.jp/tefe02/e412_c.pdf; ComponentLink1Description: http://www.tdk.co.jp/tefe02/e412_c.pdf
L8 L9 = IHLP2525CZER4R7M01: INDUCTOR POWER 4.7UH 5.5A SMD; Manufacturer: Vishay/Dale; .Checked PCB: used; Inductance: 4.7µH; Current - Saturation: 10A; Shielding: Shielded; DC Resistance (DCR): 40 mOhm Max; Tolerance: ±20%; Frequency - Test: 100kHz; .Checked SCH: used; Category: Inductors, Coils, Chokes; Manufacturer Part Number: IHLP2525CZER4R7M01; Operating Temperature: -55°C ~ 125°C; Package / Case: 0.270" L x 0.255" W x 0.118" H (6.86mm x 6.47mm x 3.00mm); Price 1k [$]: 1.09800; Value: 4µ7; Current: 5.5A; Applications: General Purpose; Supplier Part Number: 541-1010-1-ND; Supplier: Digikey; Supplier 1: Digi-Key; Supplier Part Number 1: 541-1010-1-ND; RoHS: RoHS Compliant; Stock 1: 25684; Pricing 1: 1=2.26, 10=1.83, 100=1.525, 500=1.22, 1000=1.098 (USD); Current - Temperature Rise: 5.5A; Type: -; Q @ Freq: -; Frequency - Self Resonant: -; Material - Core: -; Mounting Type: Surface Mount; Packaging: Cut Tape (CT); ComponentLink1URL: http://www.vishay.com/doc?34104; ComponentLink1Description: http://www.vishay.com/doc?34104
Q2 Q3 = SI4816BDY-T1-GE3: MOSFET DL N-CH 30V 6.8A 8-SOIC; Manufacturer: Vishay/Siliconix; .Checked PCB: used; FET Type: 2 N-Channel (Dual); FET Feature: Logic Level Gate; Rds On (Max) @ Id, Vgs: 18.5 mOhm @ 6.8A, 10V; Current - Continuous Drain (Id) @ 25° C: 5.8A, 8.2A; Vgs(th) (Max) @ Id: 3V @ 250µA; Power - Max: 1W, 1.25W; Gate Charge (Qg) @ Vgs: 10nC @ 5V; .Checked SCH: used; Category: Discrete Semiconductor Products; Manufacturer Part Number: SI4816BDY-T1-GE3; Package / Case: 8-SOIC (0.154", 3.90mm Width); Price 1k [$]: 0.84800; Value: SI4816BDY-T1-GE3; Family: FETs - Arrays; Drain to Source Voltage (Vdss): 30V; Supplier Part Number: SI4816BDY-T1-GE3CT-ND; Supplier: Digikey; Supplier 1: Digi-Key; Supplier Part Number 1: SI4816BDY-T1-GE3CT-ND; RoHS: RoHS Compliant; Stock 1: 15735; Pricing 1: 1=1.84, 25=1.4228, 100=1.2912, 250=1.1594, 500=1.0013, 1000=0.8432 (USD); Input Capacitance (Ciss) @ Vds: -; Mounting Type: Surface Mount; Supplier Device Package: 8-SOICN; Packaging: Cut Tape (CT); ComponentLink1URL: http://www.vishay.com/docs/73026/si4816bd.pdf; ComponentLink1Description: http://www.vishay.com/docs/73026/si4816bd.pdf
R123 R124 R128-R130 R133 R137 R138 = RC0402JR-070RL: as R112 on sheet [14] - RTC, EEPROM, GPIO, TOUCH SCREEN; Category: Resistors; Manufacturer Part Number: RC0402JR-070RL; Package / Case: 0402 (1005 Metric); Price 1k [$]: 0.01389; Value: 0R; .Checked SCH: used; Supplier Part Number: 311-0.0JRCT-ND; Supplier: Digikey; Supplier 1: Digi-Key; Supplier Part Number 1: 311-0.0JRCT-ND; RoHS: RoHS Compliant; Stock 1: 1106330; Pricing 1: 10=0.012, 50=0.009, 100=0.0069, 250=0.00512, 500=0.0038, 1000=0.00253 (USD); Composition: Thick Film; Features: -; Temperature Coefficient: -; Size / Dimension: 0.039" L x 0.020" W (1.00mm x 0.50mm); Height: 0.016" (0.40mm); Number of Terminations: 2; Packaging: Cut Tape (CT); ComponentLink1URL: http://www.yageo.com/documents/recent/PYu-RC0402_51_RoHS_L_6.pdf; ComponentLink1Description: http://www.yageo.com/documents/recent/PYu-RC0402_51_RoHS_L_6.pdf
R125 = RC0402FR-0710RL: RES 10.0 OHM 1/16W 1% 0402 SMD; Manufacturer: Yageo; Resistance (Ohms): 10; Power (Watts): 0.063W, 1/16W; .Checked PCB: used; Temperature Coefficient: ±200ppm/°C; Category: Resistors; Manufacturer Part Number: RC0402FR-0710RL; Package / Case: 0402 (1005 Metric); Price 1k [$]: 0.01421; Tolerance: ±1%; Value: 10R; .Checked SCH: used; Supplier Part Number: 311-10.0LRCT-ND; Supplier: Digikey; Supplier 1: Digi-Key; Supplier Part Number 1: 311-10.0LRCT-ND; RoHS: RoHS Compliant; Stock 1: 681416; Pricing 1: 10=0.014, 50=0.0104, 100=0.0079, 250=0.00584, 500=0.00432, 1000=0.00288 (USD); Composition: Thick Film; Features: -; Size / Dimension: 0.039" L x 0.020" W (1.00mm x 0.50mm); Height: 0.016" (0.40mm); Number of Terminations: 2; Packaging: Cut Tape (CT); ComponentLink1URL: http://www.yageo.com/documents/recent/PYu-RC0402_51_RoHS_L_6.pdf; ComponentLink1Description: http://www.yageo.com/documents/recent/PYu-RC0402_51_RoHS_L_6.pdf
R126 R127 = RC0402FR-071RL: RES 1.00 OHM 1/16W 1% 0402 SM; Manufacturer: Yageo; Resistance (Ohms): 1; Power (Watts): 0.063W, 1/16W; .Checked PCB: used; Description: RES 1.00 OHM 1/16W 1% 0402 SMD; Temperature Coefficient: ±200ppm/°C; Category: Resistors; Manufacturer Part Number: RC0402FR-071RL; Package / Case: 0402 (1005 Metric); Price 1k [$]: 0.01421; Tolerance: ±1%; Value: 1R; .Checked SCH: used; Supplier Part Number: 311-1.00LRCT-ND; Supplier: Digikey; Supplier 1: Digi-Key; Supplier Part Number 1: 311-1.00LRCT-ND; RoHS: RoHS Compliant; Stock 1: 347765; Pricing 1: 10=0.019, 50=0.0142, 100=0.0109, 250=0.00808, 500=0.00596, 1000=0.00397 (USD); Composition: Thick Film; Features: -; Size / Dimension: 0.039" L x 0.020" W (1.00mm x 0.50mm); Height: 0.016" (0.40mm); Number of Terminations: 2; Packaging: Cut Tape (CT); ComponentLink1URL: http://www.yageo.com/documents/recent/PYu-RC0402_51_RoHS_L_6.pdf; ComponentLink1Description: http://www.yageo.com/documents/recent/PYu-RC0402_51_RoHS_L_6.pdf
R131 R132 = RC0402FR-07200KL: RES 200K OHM 1/16W 1% 0402 SMD; Manufacturer: Yageo; Power (Watts): 0.063W, 1/16W; .Checked PCB: used; Temperature Coefficient: ±100ppm/°C; Category: Resistors; Manufacturer Part Number: RC0402FR-07200KL; Package / Case: 0402 (1005 Metric); Price 1k [$]: 0.01421; Resistance (Ohms): 200K; Tolerance: ±1%; Value: 200k; .Checked SCH: used; Supplier Part Number: 311-200KLRCT-ND; Supplier: Digikey; Supplier 1: Digi-Key; Supplier Part Number 1: 311-200KLRCT-ND; RoHS: RoHS Compliant; Stock 1: 225869; Pricing 1: 10=0.014, 50=0.0104, 100=0.0079, 250=0.00584, 500=0.00432, 1000=0.00288 (USD); Composition: Thick Film; Features: -; Size / Dimension: 0.039" L x 0.020" W (1.00mm x 0.50mm); Height: 0.016" (0.40mm); Number of Terminations: 2; Packaging: Cut Tape (CT); ComponentLink1URL: http://www.yageo.com/documents/recent/PYu-RC0402_51_RoHS_L_6.pdf; ComponentLink1Description: http://www.yageo.com/documents/recent/PYu-RC0402_51_RoHS_L_6.pdf
R134-R136 R139 R154 = RC0402FR-0710KL: as R111 on sheet [14] - RTC, EEPROM, GPIO, TOUCH SCREEN; Category: Resistors; Manufacturer Part Number: RC0402FR-0710KL; Package / Case: 0402 (1005 Metric); Price 1k [$]: 0.01421; Resistance (Ohms): 10K; Tolerance: ±1%; Value: 10k; .Checked SCH: used; Supplier Part Number: 311-10.0KLRCT-ND; Supplier: Digikey; Supplier 1: Digi-Key; Supplier Part Number 1: 311-10.0KLRCT-ND; RoHS: RoHS Compliant; Stock 1: 2916495; Pricing 1: 10=0.014, 50=0.0104, 100=0.0079, 250=0.00584, 500=0.00432, 1000=0.00288 (USD); Composition: Thick Film; Features: -; Size / Dimension: 0.039" L x 0.020" W (1.00mm x 0.50mm); Height: 0.016" (0.40mm); Number of Terminations: 2; Packaging: Cut Tape (CT); ComponentLink1URL: http://www.yageo.com/documents/recent/PYu-RC0402_51_RoHS_L_6.pdf; ComponentLink1Description: http://www.yageo.com/documents/recent/PYu-RC0402_51_RoHS_L_6.pdf
TP2 TP3 = TP_25MILC: Test Point 25mil
U15 = TLV803SDBZR: IC VOLT SUPERVISR 2.93V SOT23-3; Manufacturer: Texas Instruments; Number of Voltages Monitored: 1; Output: Open Drain or Open Collector; Reset: Active Low; Reset Timeout: 120 ms Minimum; .Creator: MM; Supplier 1: Digi-Key; Manufacturer Part Number: TLV803SDBZR; RoHS: RoHS Compliant; Category: Integrated Circuits (ICs); Stock 1: 5869; Pricing 1: 1=0.66, 10=0.578, 25=0.5104, 100=0.216, 250=0.212, 500=0.208, 750=0.204 (USD); Packaging: Cut Tape (CT); Type: Simple Reset/Power-On Reset; Voltage - Threshold: 2.93V; Operating Temperature: -40°C ~ 125°C; Mounting Type: Surface Mount; Package / Case: TO-236-3, SC-59, SOT-23-3; Supplier Device Package: SOT-23-3; ComponentLink1URL: http://www.ti.com/lit/ds/symlink/tlv803m.pdf; ComponentLink1Description: http://www.ti.com/lit/ds/symlink/tlv803m.pdf; Supplier Part Number 1: 296-29196-1-ND; .Checked PCB: MM; .Checked SCH: MM
U22 = ISL6236AIRZ: IC MAIN PWR CTRLR QUAD 32-QFN; Manufacturer: Intersil; .Checked PCB: used; Voltage - Input: 4.5 V ~ 25 V; Number of Outputs: 4; Voltage - Output: Multiple; .Checked SCH: used; Category: Integrated Circuits (ICs); Manufacturer Part Number: ISL6236AIRZ; Operating Temperature: -40°C ~ 100°C; Package / Case: 32-VFQFN Exposed Pad; Price 1k [$]: 3.0840; Value: ISL6236AIRZ; Family: PMIC - Voltage Regulators - Special Purpose; Supplier Part Number: ISL6236AIRZ-ND; Supplier: Digikey; Supplier 1: Digi-Key; Supplier Part Number 1: ISL6236AIRZ-ND; RoHS: RoHS Compliant; Stock 1: 0; Pricing 1: 600=4.28 (USD); Applications: Controller, Notebook Power System; Mounting Type: Surface Mount; Supplier Device Package: 32-QFN Exposed Pad (5x5); Packaging: Tube; ComponentLink1URL: http://www.intersil.com/data/fn/fn6453.pdf; ComponentLink1Description: http://www.intersil.com/data/fn/fn6453.pdf